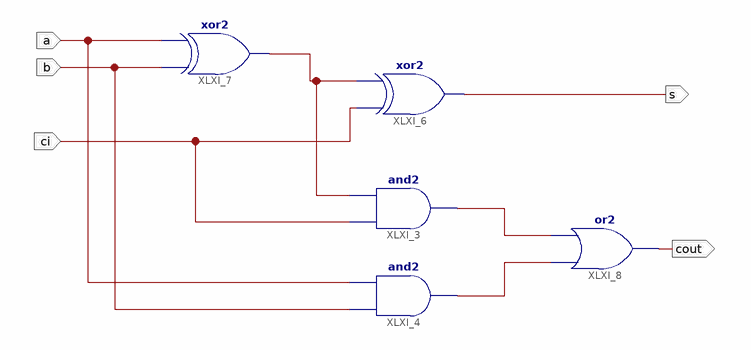
[diagram p0: schematic sheet 1]
// Xilinx ISE schematic FA.sch (xa9500xl) as structural Verilog: 5 symbols, 5 ports
module FA (
  input  a,
  input  b,
  input  ci,
  output s,
  output cout
);

  wire XLXN_2, XLXN_4, XLXN_5;

  and XLXI_3 (XLXN_4, ci, XLXN_2);
  and XLXI_4 (XLXN_5, b, a);
  xor XLXI_6 (s, ci, XLXN_2);
  xor XLXI_7 (XLXN_2, b, a);
  or XLXI_8 (cout, XLXN_5, XLXN_4);
endmodule
